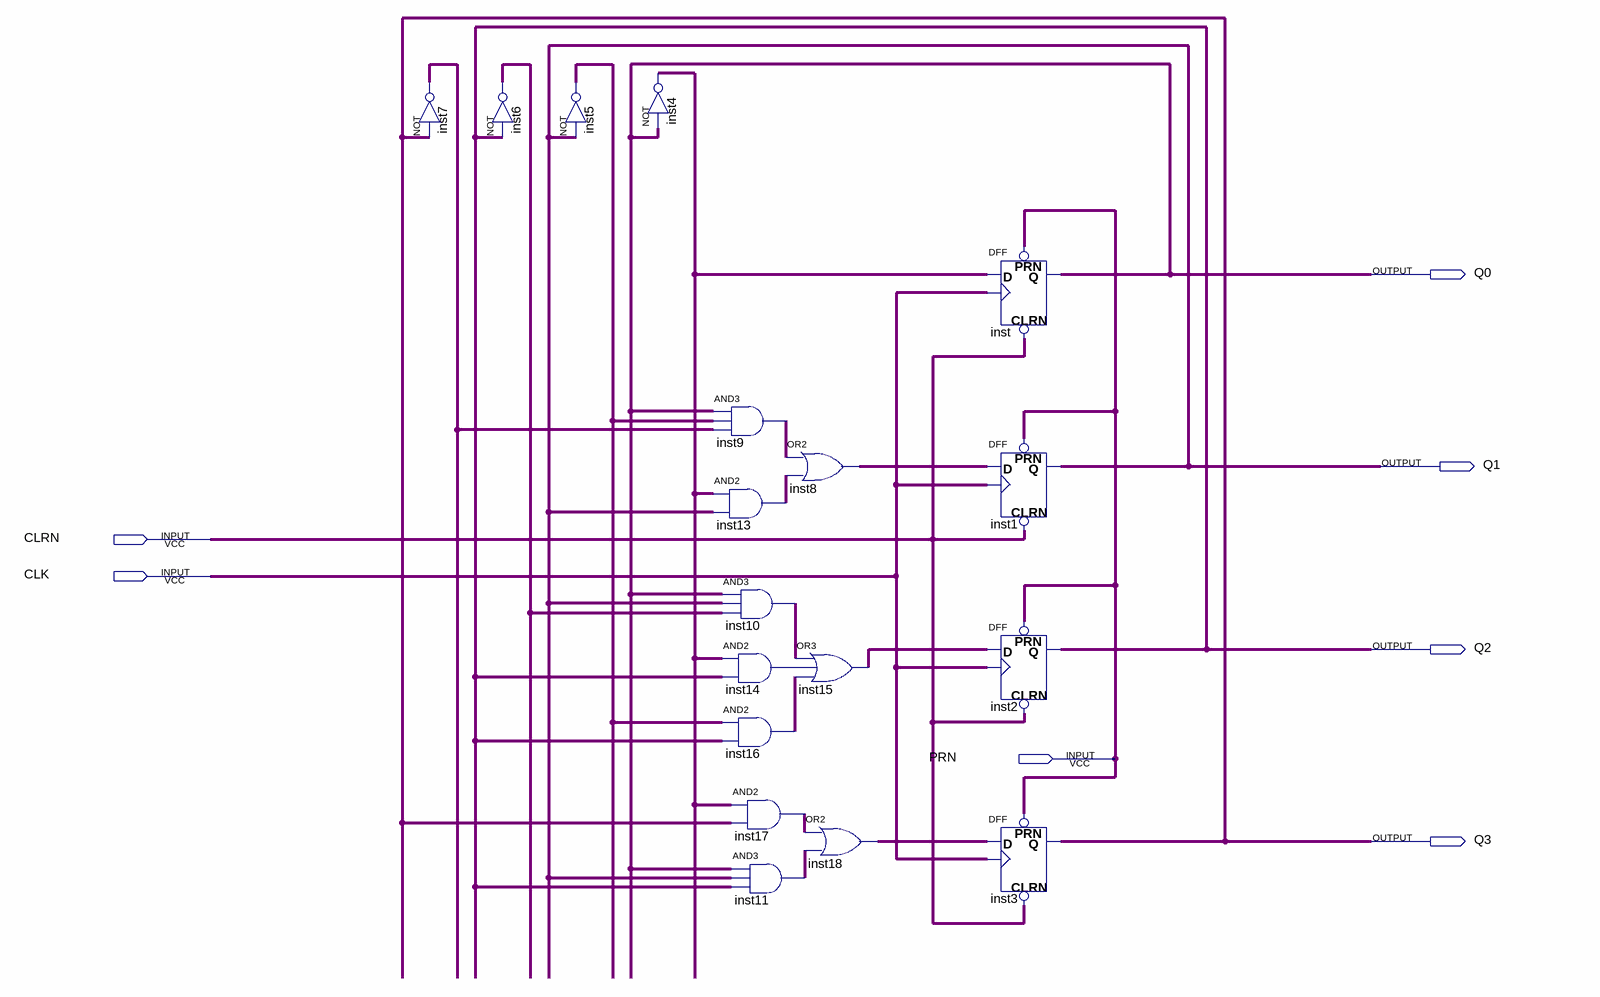
[diagram p0: schematic sheet]
// Quartus schematic BCD_COUNTER.bdf as structural Verilog: 18 symbols, 7 pins
module BCD_COUNTER (
  input  CLRN,
  input  CLK,
  input  PRN,
  output Q0,
  output Q1,
  output Q2,
  output Q3
);

  wire inst4_out, inst5_out, inst6_out, inst7_out, inst8_out, inst9_out, inst10_out, inst11_out, inst13_out,
       inst14_out, inst15_out, inst16_out, inst17_out, inst18_out;

  not inst7 (inst7_out, Q3);
  not inst6 (inst6_out, Q2);
  not inst5 (inst5_out, Q1);
  not inst4 (inst4_out, Q0);
  and inst9 (inst9_out, Q0, inst5_out, inst7_out);
  and inst13 (inst13_out, inst4_out, Q1);
  and inst10 (inst10_out, Q0, Q1, inst6_out);
  and inst14 (inst14_out, inst4_out, Q2);
  and inst16 (inst16_out, inst5_out, Q2);
  and inst17 (inst17_out, inst4_out, Q3);
  and inst11 (inst11_out, Q0, Q1, Q2);
  or inst8 (inst8_out, inst9_out, inst13_out);
  or inst15 (inst15_out, inst10_out, inst14_out, inst16_out);
  or inst18 (inst18_out, inst17_out, inst11_out);
  DFF inst (.CLRN(CLRN), .CLK(CLK), .D(inst4_out), .PRN(PRN), .Q(Q0));
  DFF inst1 (.CLRN(CLRN), .CLK(CLK), .D(inst8_out), .PRN(PRN), .Q(Q1));
  DFF inst2 (.CLRN(CLRN), .CLK(CLK), .D(inst15_out), .PRN(PRN), .Q(Q2));
  DFF inst3 (.CLRN(CLRN), .CLK(CLK), .D(inst18_out), .PRN(PRN), .Q(Q3));
endmodule
